# EAGLE design Controller (EAGLE 9.6.2)

## Sheet 1 of 2
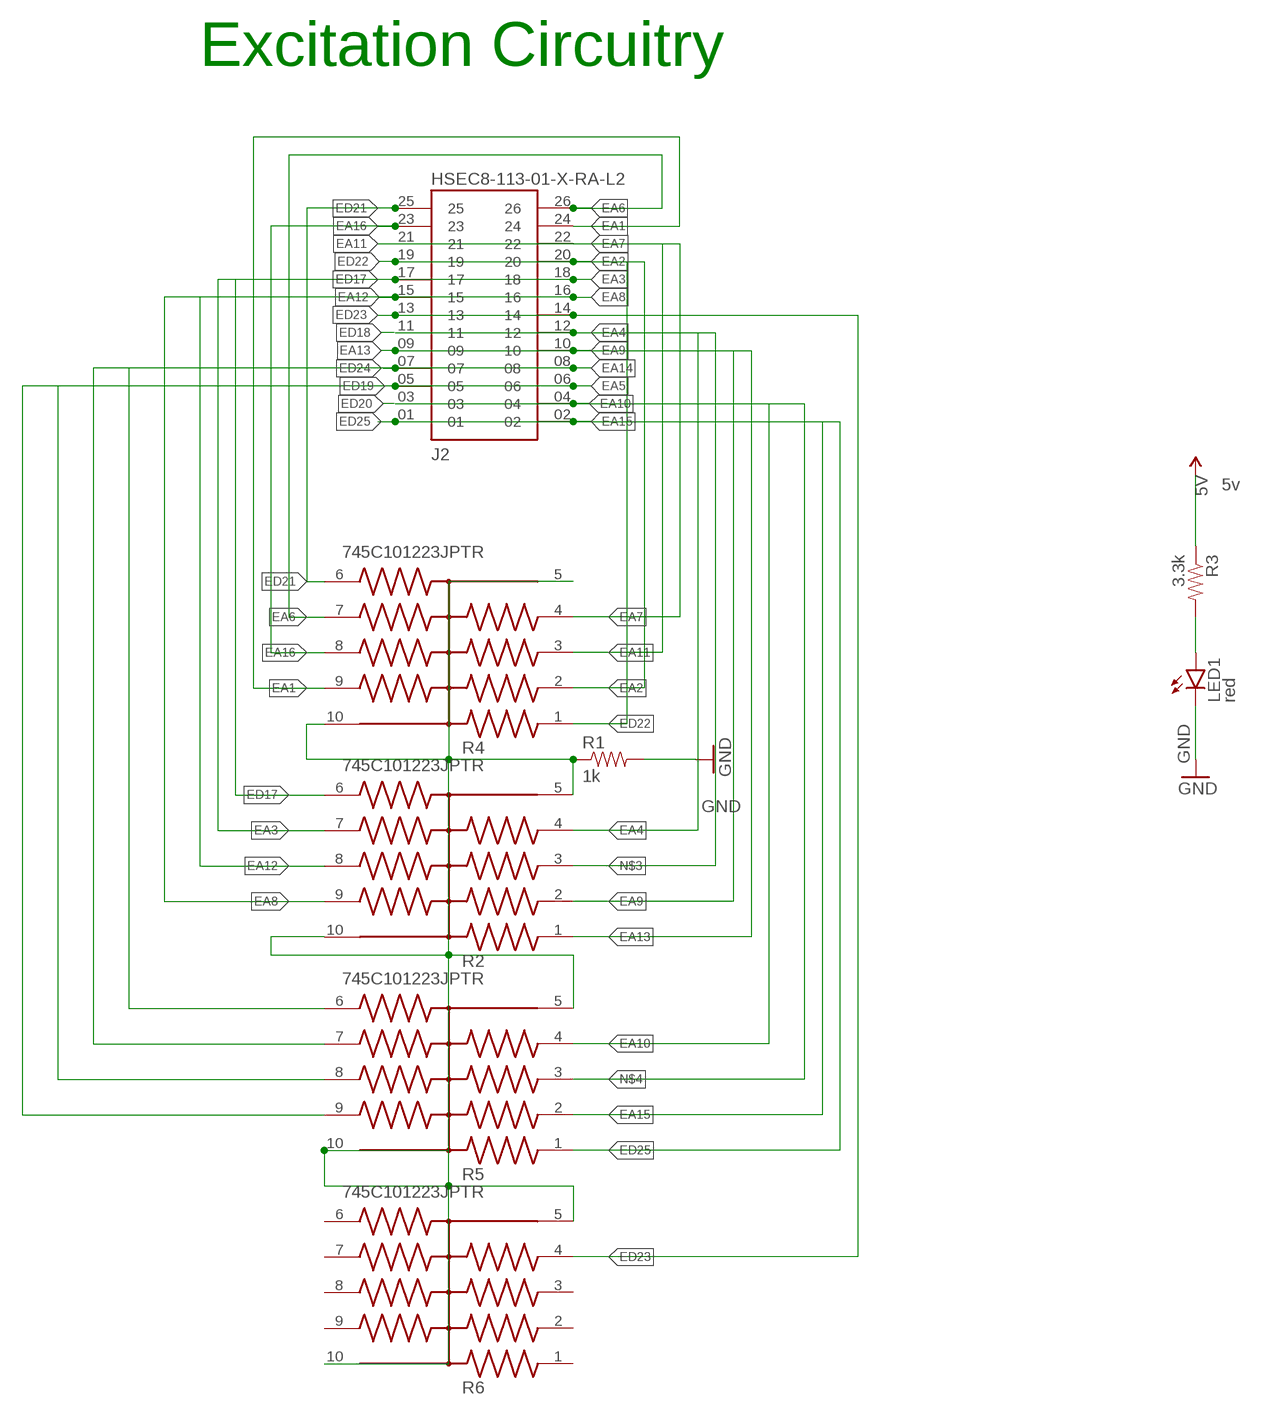
[diagram p0: schematic, sheet 1, part 1 of 2]
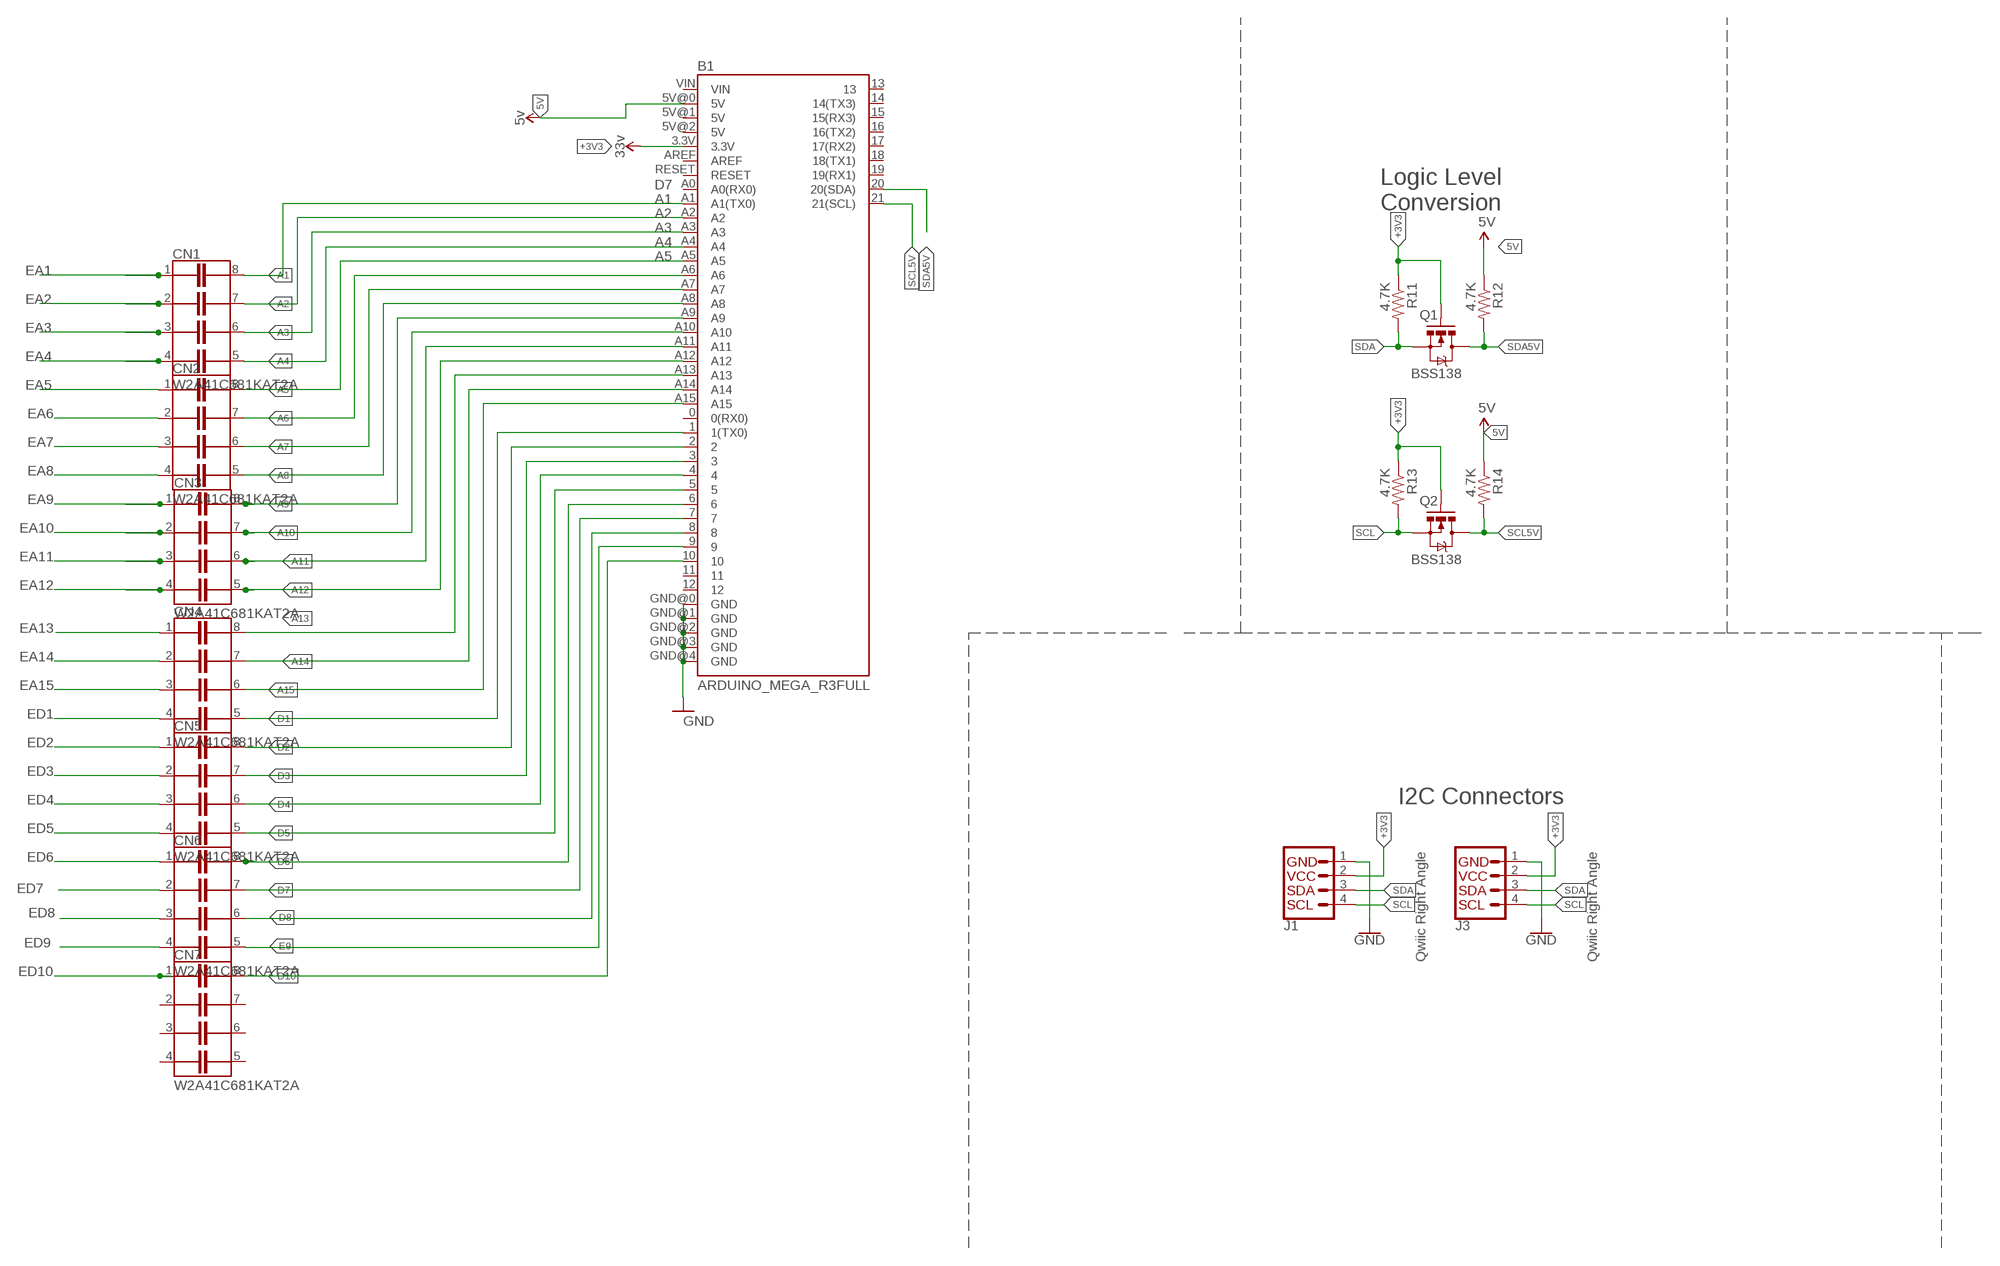
[diagram p1: schematic, sheet 1, part 2 of 2]

### Parts
B1  ARDUINO_MEGA_R3FULL  [ARDUINO_MEGA]
CN1  W2A41C681KAT2A  [CAPCAXE50P210X130X94-8N]
CN2  W2A41C681KAT2A  [CAPCAXE50P210X130X94-8N]
CN3  W2A41C681KAT2A  [CAPCAXE50P210X130X94-8N]
CN4  W2A41C681KAT2A  [CAPCAXE50P210X130X94-8N]
CN5  W2A41C681KAT2A  [CAPCAXE50P210X130X94-8N]
CN6  W2A41C681KAT2A  [CAPCAXE50P210X130X94-8N]
CN7  W2A41C681KAT2A  [CAPCAXE50P210X130X94-8N]
J1  Qwiic Right Angle  I2C_STANDARDQWIIC  [1X04_1MM_RA]
J2  HSEC8-113-01-X-RA-L2  [SAMTEC_HSEC8-113-01-X-RA-L2]
J3  Qwiic Right Angle  I2C_STANDARDQWIIC  [1X04_1MM_RA]
LED1  red  LED1206  [LED-1206]
Q1  BSS138  MOSFET-NCHANNELBSS138  [SOT23-3]
Q2  BSS138  MOSFET-NCHANNELBSS138  [SOT23-3]
R1  1k  RESISTOR0402  [0402]
R2  745C101223JPTR  [RESCAV127P640X310X70-10N]
R3  3.3k  RESISTOR0402  [0402]
R4  745C101223JPTR  [RESCAV127P640X310X70-10N]
R5  745C101223JPTR  [RESCAV127P640X310X70-10N]
R6  745C101223JPTR  [RESCAV127P640X310X70-10N]
R11  4.7K  4.7KOHM-1/10W-1%(0603)  [0603-RES]
R12  4.7K  4.7KOHM-1/10W-1%(0603)  [0603-RES]
R13  4.7K  4.7KOHM-1/10W-1%(0603)  [0603-RES]
R14  4.7K  4.7KOHM-1/10W-1%(0603)  [0603-RES]

### Nets
5V: B1.5V@0(5V) R3.1 R12.1 R14.1 ; supply symbol labelled 5v
+3V3 [power]: B1.3.3V J1.2 J3.2 Q1.1(G) Q2.1(G) R11.1 R13.1 ; supply symbol labelled 33v
A1: B1.A1(A1(TX0)) CN1.8
A2: B1.A2 CN1.7
A3: B1.A3 CN1.6
A4: B1.A4 CN1.5
A5: B1.A5 CN2.8
A6: B1.A6 CN2.7
A7: B1.A7 CN2.6
A8: B1.A8 CN2.5
A9: B1.A9 CN3.8
A10: B1.A10 CN3.7
A11: B1.A11 CN3.6
A12: B1.A12 CN3.5
A13: B1.A13 CN4.8
A14: B1.A14 CN4.7
A15: B1.A15 CN4.6
D1: B1.1(1(TX0)) CN4.5
D2: B1.2 CN5.8
D3: B1.3 CN5.7
D4: B1.4 CN5.6
D5: B1.5 CN5.5
D6: B1.6 CN6.8
D7: B1.7 CN6.7
D8: B1.8 CN6.6
D10: B1.10 CN7.8
E9: B1.9 CN6.5
EA1: CN1.1 J2.24 R4.9
EA2: CN1.2 J2.20 R4.2
EA3: CN1.3 J2.18 R2.7
EA4: CN1.4 J2.12 R2.4
EA5: CN2.1 J2.06 R5.9
EA6: CN2.2 J2.26 R4.7
EA7: CN2.3 J2.22 R4.4
EA8: CN2.4 J2.16 R2.9
EA9: CN3.1 J2.10 R2.2
EA10: CN3.2 J2.04 R5.4
EA11: CN3.3 J2.21 R4.3
EA12: CN3.4 J2.15 R2.8
EA13: CN4.1 J2.09 R2.1
EA14: CN4.2 J2.08 R5.7
EA15: CN4.3 J2.02 R5.2
EA16: J2.23 R4.8
ED1: CN4.4
ED2: CN5.1
ED3: CN5.2
ED4: CN5.3
ED5: CN5.4
ED6: CN6.1
ED7: CN6.2
ED8: CN6.3
ED9: CN6.4
ED10: CN7.1
ED17: J2.17 R2.6
ED19: J2.05 R5.8
ED21: J2.25 R4.6
ED22: J2.19 R4.1
ED23: J2.13 J2.14 R6.4
ED24: J2.07 R5.6
ED25: J2.01 R5.1
GND: B1.GND@0(GND) B1.GND@1(GND) B1.GND@2(GND) B1.GND@3(GND) B1.GND@4(GND) J1.1 J3.1 LED1.C R1.2
N$1: LED1.A R3.2
N$2: R1.1 R2.5 R2.10 R4.5 R4.10 R5.5 R5.10 R6.5 R6.10
N$3: J2.11 R2.3
N$4: J2.03 R5.3
SCL: J1.4 J3.4 Q2.2(S) R13.2
SCL5V: B1.21(21(SCL)) Q2.3(D) R14.2
SDA: J1.3 J3.3 Q1.2(S) R11.2
SDA5V: B1.20(20(SDA)) Q1.3(D) R12.2
Unconnected: B1.0(0(RX0)) B1.5V@1(5V) B1.5V@2(5V) B1.11 B1.12 B1.13 B1.14(14(TX3)) B1.15(15(RX3)) B1.16(16(TX2)) B1.17(17(RX2)) B1.18(18(TX1)) B1.19(19(RX1)) B1.A0(A0(RX0)) B1.AREF B1.RESET B1.VIN CN7.2 CN7.3 CN7.4 CN7.5 CN7.6 CN7.7 R6.1 R6.2 R6.3 R6.6 R6.7 R6.8 R6.9

### Notes on the sheet
- Excitation Circuitry
- Logic Level
  Conversion
- I2C Connectors

## Sheet 2 of 2

## Library data of the parts
B1 = shields:ARDUINO_MEGA_R3: Arduino Mega R3 ATmega2560 R3 compatible footprint with additional header pins removed
CN1-CN7 = W2A41C681KAT2A:W2A41C681KAT2A: Cap Ceramic Array 680pF 100V X7R 10% 0508 SMD 4 Capacitor 125°C Paper T/R/Embossed T/R Check availability <https://pricing.snapeda.com/parts/W2A41C681KAT2A/AVX/view-part?ref=eda>; AVAILABILITY: In Stock; DESCRIPTION: 680pF Isolated Capacitor 4 Array 100 V X7R 0508 (1220 Metric); MF: AVX; MP: W2A41C681KAT2A; PACKAGE: 0508 AVX; PRICE: None; PURCHASE-URL: https://pricing.snapeda.com/search?q=W2A41C681KAT2A&ref=eda
J1 J3 = SparkFun-Connectors:I2C_STANDARD: SparkFun I2C Standard Pinout Header SparkFun has standardized on a pinout for all I2C based sensor breakouts. This pinout allows I2C boards to be plugged directly into the headers on Arduino Uno compatible boards, and to be daisy chained easily. Example SparkFun Products: SparkFun Atmospheric Sensor Breakout - BME280 <https://www.sparkfun.com/products/13676> SparkFun Altitude/Pressure Sensor Breakout - MPL3115A2 <https://www.sparkfun.com/products/11084> SparkFun TOF Range Finder Sensor - VL6180 <https://www.sparkfun.com/products/12785>; PROD_ID: CONN-13729
J2 = HSEC8-113-01:HSEC8-113-01-X-RA-L2: 26 Position Female Connector Non Specified - Dual Edge Gold 0.031" (0.80mm) Black; MANUFACTURER: Samtec; MAXIMUM_PACKAGE_HEIGHT: 5.2 mm; PARTREV: Z; STANDARD: Manufacturer Recommendations
LED1 = SparkFun-LED:LED: LED (Generic) Standard schematic elements and footprints for 5mm, 3mm, 1206, and 0603 sized LEDs. Generic LEDs with no color specified.
Q1 Q2 = SparkFun-DiscreteSemi:MOSFET-NCHANNEL: Common NMOSFET Parts MFG P/N Store ID Prod ID FDD8780 TRANS-09984 SI7820DN TRANS-11055 FDS6630A IC-08089 2N7002PW TRANS-11151 FQP30N06L COM-10213 TRANS-10060 BSS123LT1G TRANS-08345 BSS138 TRANS-00830 BS170 2N7000; PROD_ID: TRANS-00830; VALUE: 200mA/50V
R1 R3 = SparkFun-Resistors:RESISTOR: Generic Resistor Package
R2 R4-R6 = 745C101223JPTR:745C101223JPTR: Res Thick Film Array 1K Ohm 5% 1/2W Â±200ppm/Â°C BUS Molded 10-Pin 2512 Concave SMD Plastic T/R Check availability <https://pricing.snapeda.com/parts/745C101223JPTR/CTS%20Components/view-part?ref=eda>; AVAILABILITY: In Stock; DESCRIPTION: RES ARRAY 8 RES 22K OHM 2512; MF: CTS Components; MP: 745C101223JPTR; PACKAGE: 2512 CTS Components; PRICE: None
R11-R14 = SparkFun-Resistors:4.7KOHM-1/10W-1%(0603): RES-07857; PROD_ID: RES-07857

## Net classes
0 Default: width 0.203 mm
1 power: width 0.61 mm, drill 0.61 mm, clearance 0.254 mm
2 gnd: width 0.305 mm, drill 0.559 mm, clearance 0.254 mm

## Board
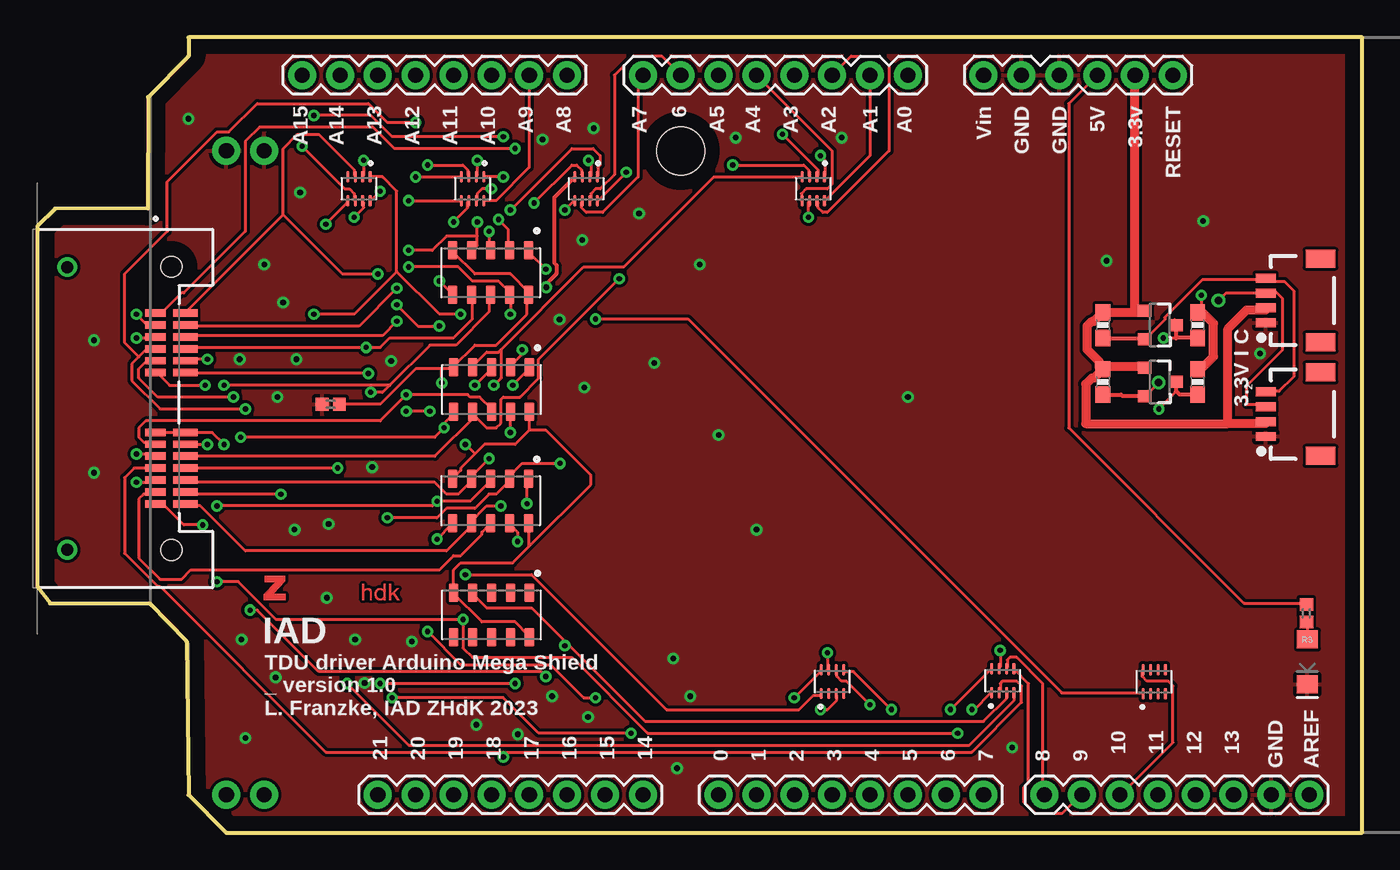
[diagram p2: board, top side]
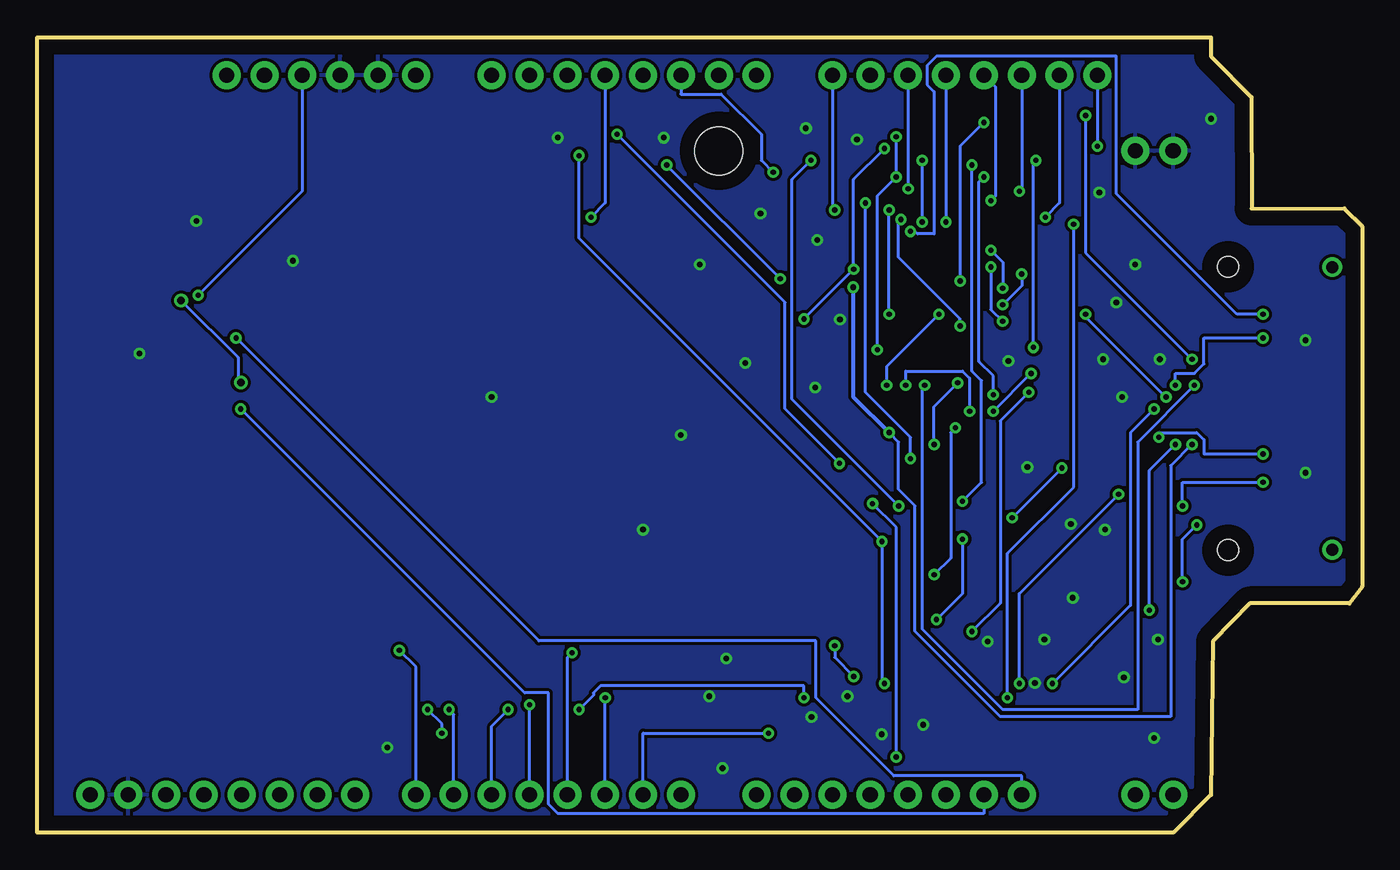
[diagram p3: board, bottom side, seen from below]

Size 88.89 x 53.34 mm. Coordinates in mm from the lower left corner, seen from the top.
Outline: 88.89,53.34 10.15,53.34 10.15,52.07 7.44,49.32 7.42,41.86 1.2,41.85 0,40.66 0,16.5 0.86,15.38 7.56,15.38 10.02,12.83 10.15,2.54 12.69,0 88.89,0 88.89,53.34
Copper layers (1*16): Top 0.035mm / dielectric 1.5mm / Bottom 0.035mm
Design rules "default *": minimum track width 6mil, minimum drill 0.35mm, track to track 8mil, track to pad 8mil, pad to pad 8mil, via to via 8mil, smd to smd 0mil, copper to edge 40mil, drill to drill 6mil, minimum pad ring 10mil, minimum via ring 8mil, stop-mask expansion 0mil, vias tented up to drill 15mil, thermal gap 10mil

### Footprints (pad centres in the part's own frame; a part is rotated, then mirrored left to right if it is on the bottom)
ARDUINO_MEGA = drill 1.016 pad 1.88: 0 13.97,24.13; 1 11.43,24.13; 2 8.89,24.13; 3 6.35,24.13; 3.3V -13.97,-24.13; 4 3.81,24.13; 5 1.27,24.13; 5V@0 -11.43,-24.13; 5V@1 44.45,24.13; 5V@2 46.99,24.13; 6 -1.27,24.13; 7 -3.81,24.13; 8 -7.874,24.13; 9 -10.414,24.13; 10 -12.954,24.13; 11 -15.494,24.13; 12 -18.034,24.13; 13 -20.574,24.13; 14 19.05,24.13; 15 21.59,24.13; 16 24.13,24.13; 17 26.67,24.13; 18 29.21,24.13; 19 31.75,24.13; 20 34.29,24.13; 21 36.83,24.13; A0 1.27,-24.13; A1 3.81,-24.13; A2 6.35,-24.13; A3 8.89,-24.13; A4 11.43,-24.13; A5 13.97,-24.13; A6 16.51,-24.13; A7 19.05,-24.13; A8 24.13,-24.13; A9 26.67,-24.13; A10 29.21,-24.13; A11 31.75,-24.13; A12 34.29,-24.13; A13 36.83,-24.13; A14 39.37,-24.13; A15 41.91,-24.13; AREF -25.654,24.13; GND@0 -8.89,-24.13; GND@1 -6.35,-24.13; GND@2 44.45,-19.05; GND@3 46.99,-19.05; GND@4 -23.114,24.13; RESET -16.51,-24.13; VIN -3.81,-24.13 | hole 3.2: 16.51,-19.05
CAPCAXE50P210X130X94-8N = smd 0.77 x 0.21: 1 -0.8,0.75; 2 -0.8,0.25; 3 -0.8,-0.25; 4 -0.8,-0.75; 5 0.8,-0.75; 6 0.8,-0.25; 7 0.8,0.25; 8 0.8,0.75
1X04_1MM_RA = smd 0.6 x 1.35: 1 -1.5,0; 2 -0.5,0; 3 0.5,0; 4 1.5,0 | smd 1.2 x 2: NC1 2.8,-3.675; NC2 -2.8,-3.675
SAMTEC_HSEC8-113-01-X-RA-L2 = smd 0.5 x 1.35: 01 -6.4,-1.075; 03 -5.6,-1.075; 05 -4.8,-1.075; 07 -4,-1.075; 09 -3.2,-1.075; 11 -2.4,-1.075; 13 1.6,-1.075; 15 2.4,-1.075; 17 3.2,-1.075; 19 4,-1.075; 21 4.8,-1.075; 23 5.6,-1.075; 25 6.4,-1.075 | smd 0.5 x 1.65: 02 -6.4,0.925; 04 -5.6,0.925; 06 -4.8,0.925; 08 -4,0.925; 10 -3.2,0.925; 12 -2.4,0.925; 14 1.6,0.925; 16 2.4,0.925; 18 3.2,0.925; 20 4,0.925; 22 4.8,0.925; 24 5.6,0.925; 26 6.4,0.925 | drill 0.81: S1 -9.48,-7; S2 9.48,-7 | hole 1.4: -9.5,0; 9.5,0
LED-1206 = smd 1.2 x 1.4: A -1.5,0; C 1.5,0
SOT23-3 = smd 0.8 x 0.9: 1 -0.95,-1; 2 0.95,-1; 3 0,1.1
0402 = smd 0.85 x 0.9: 1 -0.58,0; 2 0.58,0
RESCAV127P640X310X70-10N = smd 1.23 x 0.63: 1 -1.495,2.54; 2 -1.495,1.27; 3 -1.495,0; 4 -1.495,-1.27; 5 -1.495,-2.54; 6 1.495,-2.54; 7 1.495,-1.27; 8 1.495,0; 9 1.495,1.27; 10 1.495,2.54
0603-RES = smd 1.1 x 1: 1 -0.85,0; 2 0.85,0

### Placement (x,y rotation side)
B1  59.68,26.67 180 top
CN1  52.06,43.18 270 top
CN2  36.82,43.18 270 top
CN3  29.2,43.18 270 top
CN4  21.58,43.18 270 top
CN5  53.34,10.13 90 top
CN6  64.77,10.19 90 top
CN7  74.93,10.13 90 top
J1  82.41,35.69 90 top
J2  9.01,28.45 270 top
J3  82.41,28.07 90 top
LED1  85.21,11.46 270 top
Q1  75.3,30.23 270 top
Q2  75.3,34.04 270 top
R1  19.7,28.73 180 top
R2  30.47,29.72 270 top
R3  85.14,14.72 270 top
R4  30.41,22.25 270 top
R5  30.41,37.55 270 top
R6  30.47,14.61 270 top
R11  71.49,30.23 270 top
R12  77.84,30.23 270 top
R13  71.49,34.04 270 top
R14  77.84,34.04 270 top
U$1  [ZHDK_LOGO]  14.47,17.78 0 top

### Tracks (layer width: path | path; a pad name or v marks a point on that pad's centre or on a via)
5V  (via drill 0.35)
  Top 0.203: R12.1 77.93,31.12 78.05,31.08 | B1.5V@0 69.2,48.9 69.2,27.15 80.95,15.4 85.08,15.4 R3.1 | v78.09,36.04 78.09,35.24 R14.1
  Top 0.61: R14.1 78.01,35.05 78.9,34.16 78.9,31.92 78.05,31.08
  Bottom 0.203: v78.09,36.04 71.11,43.02 B1.5V@0
+3V3
  Top 0.61: 79.87,27.43 79.87,33.78 81.14,35.05 82.41,35.05 J1.2 | 79.87,27.43 82.41,27.43 J3.2 | 71.24,31.24 74.41,31.24 Q1.1 | 74.09,35.05 73.65,35.05 B1.3.3V | 74.09,35.05 Q2.1 | 71.55,35.05 R13.1 | 71.24,31.24 R11.1 70.9,30.48 70.76,30.48 70.35,30.07 70.35,27.43 79.87,27.43 | R13.1 70.9,34.3 70.76,34.3 70.43,33.97 70.43,32.41 71.24,31.6 71.24,31.24 | R13.1 73.93,34.89 74.09,35.05
A1
  Top 0.203: B1.A1 55.87,45.4 52.85,42.39 CN1.8
A2
  Top 0.203: B1.A2 54.6,52.07 56.5,52.07 57.14,51.44 57.14,45.72 53.01,41.59 52.69,41.59 52.38,41.91 52.38,42.23 CN1.7
A3  (via drill 0.35)
  Top 0.203: v51.74,41.27 51.74,42.23 CN1.6
  Bottom 0.203: v51.74,41.27 50.79,42.23 B1.A3
A4
  Top 0.203: B1.A4 53.33,45.72 53.33,43.5 53.01,43.18 51.58,43.18 51.26,42.86 51.26,42.39 CN1.5
A5  (via drill 0.35)
  Top 0.203: v39.52,44.29 37.61,42.39 CN2.8
  Bottom 0.203: v39.52,44.29 40.31,45.09 40.31,46.83 43.01,49.53 45.71,49.53 B1.A5
A6
  Top 0.203: B1.A6 41.9,52.07 39.99,52.07 38.72,50.8 38.72,44.13 37.77,43.18 37.45,43.18 37.14,42.86 37.14,42.39 CN2.7
A7
  Top 0.203: B1.A7 40.31,50.48 40.31,43.97 37.93,41.59 36.82,41.59 36.5,41.91 36.5,42.23 CN2.6
A8  (via drill 0.35)
  Top 0.203: CN2.5 36.02,42.38 v35.39,41.75
  Bottom 0.203: v35.39,41.75 35.55,41.91 B1.A8
A9
  Top 0.203: B1.A9 33.01,44.61 30.79,42.39 29.99,42.39 CN3.8
A10  (via drill 0.35)
  Top 0.203: v30.47,43.18 29.83,43.18 29.52,42.86 29.52,42.39 CN3.7
  Bottom 0.203: B1.A10 v30.47,43.18
A11  (via drill 0.35)
  Top 0.203: v27.93,40.96 28.88,41.91 28.88,42.23 CN3.6
  Bottom 0.203: B1.A11 v27.93,40.96
A12  (via drill 0.35)
  Top 0.203: v24.91,42.39 28.4,42.39 CN3.5
  Bottom 0.203: v24.91,42.39 24.59,42.7 24.59,50.01 B1.A12
A13  (via drill 0.35)
  Top 0.203: v23.01,43.02 22.37,42.39 CN4.8
  Bottom 0.203: v23.01,43.02 22.85,43.18 B1.A13
A14  (via drill 0.35)
  Top 0.203: v21.26,41.27 21.9,41.91 21.9,42.23 CN4.7
  Bottom 0.203: v21.26,41.27 20.31,42.23 B1.A14
A15  (via drill 0.35)
  Top 0.203: v17.77,46.04 20.63,43.18 20.94,43.18 21.26,42.86 21.26,42.39 CN4.6
  Bottom 0.203: B1.A15 v17.77,46.04
D1  (via drill 0.35)
  Top 0.203: v19.36,40.8 20.78,42.23 CN4.5 | v23.8,9.05 31.26,9.05 33.64,6.67 v39.83,6.67
  Bottom 0.203: v19.36,40.8 19.36,23.18 23.8,18.73 v23.8,9.05 | v39.83,6.67 48.25,6.67 B1.1
D2  (via drill 0.35)
  Top 0.203: v50.79,9.05 52.53,10.8 CN5.8
  Bottom 0.203: B1.2 v50.79,9.05
D3  (via drill 0.35)
  Top 0.203: v53.01,12.07 53.01,10.95 CN5.7
  Bottom 0.203: v53.01,12.07 53.33,11.75 B1.3
D4  (via drill 0.35)
  Top 0.203: v55.87,8.57 54.28,10.16 53.96,10.16 53.65,10.48 53.65,10.8 CN5.6
  Bottom 0.203: B1.4 v55.87,8.57
D5  (via drill 0.35)
  Top 0.203: v57.3,8.25 54.76,10.8 54.12,10.8 CN5.5
  Bottom 0.203: v57.3,8.25 58.41,7.14 B1.5
D6  (via drill 0.35)
  Top 0.203: v61.27,8.25 63.96,10.95 CN6.8
  Bottom 0.203: v61.27,8.25 60.95,7.94 B1.6
D7  (via drill 0.35)
  Top 0.203: v64.6,12.22 64.6,11.11 CN6.7
  Bottom 0.203: v64.6,12.22 63.49,11.11 B1.7
D8
  Top 0.203: CN6.6 65.08,11.11 65.08,11.59 65.23,11.75 65.71,11.75 67.46,10 67.46,2.54 B1.8
D10
  Top 0.203: CN7.8 74.12,10.8 74.12,10.48 74.44,10.16 75.87,10.16 76.19,9.84 76.19,6.03 72.7,2.54 B1.10
E9
  Top 0.203: CN6.5 65.55,10.95 66.5,10 66.5,3.33 66.19,3.02 66.19,2.06 66.98,1.27 68.73,1.27 70,2.54 B1.9
EA1  (via drill 0.35)
  Top 0.203: v52.53,45.4 52.85,45.09 52.85,44.13 CN1.1 | v32.21,19.53 32.21,20.16 31.74,20.64 R4.9 | v16.34,22.7 9.99,22.7 J2.24 | v32.06,10 v23.01,10
  Bottom 0.203: v52.53,45.4 52.53,39.85 v32.21,19.53 32.21,10.16 v32.06,10 | v16.34,22.7 23.01,16.03 v23.01,10
EA2  (via drill 0.35)
  Top 0.203: v49.99,46.83 52.38,44.45 52.38,44.13 CN1.2 | v35.07,24.77 32.53,24.77 31.58,23.81 R4.2 31.74,23.65 30.79,22.7 30.31,22.7 29.36,21.75 27.45,21.75 26.82,21.11 v23.48,21.11 | v20.15,24.45 9.99,24.45 J2.20
  Bottom 0.203: v49.99,46.83 38.72,35.56 38.72,28.42 v35.07,24.77 | v23.48,21.11 v20.15,24.45
EA3  (via drill 0.35)
  Top 0.203: v46.66,44.77 51.42,44.77 51.74,44.45 51.74,44.13 CN1.3 | v39.04,37.15 33.64,31.75 33.64,30.48 32.37,29.21 31.26,29.21 31.1,29.05 31.1,27.46 30.79,27.15 30.15,27.15 29.36,27.94 | 29.36,27.94 29.2,28.1 R2.7 29.36,27.94 | 29.36,27.94 26.66,25.24 9.99,25.24 J2.18
  Bottom 0.203: v39.04,37.15 v46.66,44.77
EA4  (via drill 0.35)
  Top 0.203: 31.1,32.38 30.94,32.23 30.15,32.23 29.2,31.27 R2.4 | 31.1,32.38 36.66,37.94 39.36,37.94 45.39,43.97 51.26,43.97 CN1.4 | v22.21,30.8 9.99,30.8 J2.12 | v26.34,28.26 v24.75,28.26 | v30.63,30 31.1,30.48 31.1,32.38
  Bottom 0.203: v24.75,28.26 v22.21,30.8 | v26.34,28.26 26.34,30.48 26.82,30.96 30.63,30.96 v30.63,30
EA5  (via drill 0.35)
  Top 0.203: v31.74,41.75 35.87,45.88 37.29,45.88 37.77,45.4 37.77,44.77 37.61,44.61 37.61,44.13 CN2.1 | v31.74,34.77 31.74,36.04 R5.9 31.74,36.2 30.94,36.99 29.2,36.99 28.25,37.94 v24.91,37.94 | v24.12,34.29 23.17,33.34 9.99,33.34 J2.06
  Bottom 0.203: v31.74,34.77 v31.74,41.75 | v24.12,34.29 24.91,35.08 v24.91,37.94
EA6  (via drill 0.35)
  Top 0.203: v36.98,45.09 37.14,44.93 37.14,44.13 CN2.2 | v31.1,21.91 30.15,21.91 29.04,20.8 R4.7 29.2,20.64 27.45,18.89 13.96,18.89 10.94,21.91 9.99,21.91 J2.26
  Bottom 0.203: v36.98,45.09 38.25,43.81 38.25,29.05 v31.1,21.91
EA7  (via drill 0.35)
  Top 0.203: v33.33,42.23 35.87,44.77 36.18,44.77 36.5,44.45 36.5,44.13 CN2.3 | v30.31,25.08 29.04,23.81 R4.4 29.2,23.65 28.25,22.7 27.45,22.7 26.66,23.49 9.99,23.49 J2.22
  Bottom 0.203: v33.33,42.23 33.33,29.53 30.31,26.51 v30.31,25.08
EA8  (via drill 0.35, 0.38)
  Top 0.203: v31.74,26.83 R2.9 | v11.42,26.04 9.99,26.04 J2.16
  Top 0.254: v34.15,36.58 34.15,36.81 34.83,37.49 34.83,38.08 34.68,38.22 34.68,42.59 CN2.4
  Bottom 0.203: v31.74,26.83 31.66,26.75 31.1,26.19 31.1,23.02 29.99,21.91 29.99,13.49 24.28,7.78 12.85,7.78 12.85,24.61 v11.42,26.04
  Bottom 0.254: v34.15,36.58 34.15,29.24 31.66,26.75
EA9  (via drill 0.35)
  Top 0.203: v31.26,43.97 29.99,43.97 CN3.1 | v32.53,32.38 32.53,32.07 31.74,31.27 R2.2 | v11.42,31.75 9.99,31.75 J2.10 | v18.56,48.1 22.37,48.1 23.8,46.67 v31.26,46.67
  Bottom 0.203: v32.53,32.38 32.53,42.7 v31.26,43.97 v31.26,46.67 | v11.42,31.75 18.56,38.89 v18.56,48.1
EA10  (via drill 0.35)
  Top 0.203: v29.52,45.09 29.52,44.13 CN3.2 | 29.52,40.01 29.52,39.37 29.2,39.05 R5.4 | 29.52,40.01 v29.52,40.96 | v24.12,36.51 21.58,33.97 9.99,33.97 J2.04 | v24.91,39.05 26.5,39.05 27.45,40.01 29.52,40.01
  Bottom 0.203: v29.52,40.96 v29.52,45.09 | v24.12,36.51 24.12,38.26 v24.91,39.05
EA11  (via drill 0.35)
  Top 0.203: v26.18,44.77 28.56,44.77 28.88,44.45 28.88,44.13 CN3.3 | R4.3 30.47,23.65 29.04,22.23 v26.82,22.23 26.5,21.91 v12.05,21.91 | v6.66,23.49 7.93,23.49 J2.21
  Bottom 0.203: v26.18,44.77 26.18,30.96 25.55,30.32 25.55,23.49 v26.82,22.23 | v6.66,23.49 12.05,23.49 v12.05,21.91
EA12  (via drill 0.35)
  Top 0.203: v25.39,43.97 28.4,43.97 CN3.4 | R2.8 30.47,28.42 29.67,29.21 29.04,29.21 28.88,29.37 v24.75,29.37 23.01,27.62 7.29,27.62 6.81,27.15 6.81,26.51 7.13,26.19 7.93,26.19 J2.15
  Bottom 0.203: v25.39,43.97 25.71,43.66 25.71,31.59 24.75,30.64 v24.75,29.37
EA13  (via drill 0.35)
  Top 0.203: 24.12,37.62 24.12,43.02 23.17,43.97 22.37,43.97 CN4.1 | 24.12,37.62 26.98,34.77 v28.4,34.77 | v31.9,30 33.01,31.12 R2.1 | v13.16,29.21 8.08,29.21 6.81,30.48 6.81,31.12 7.29,31.59 7.93,31.59 J2.09 | v18.56,34.77 21.26,34.77 24.12,37.62
  Bottom 0.203: v28.4,34.77 31.9,31.27 v31.9,30 | v13.16,29.21 18.56,34.61 v18.56,34.77
EA14  (via drill 0.35)
  Top 0.203: v21.9,45.09 21.9,44.13 CN4.2 | J2.08 9.99,32.54 v22.05,32.54 23.01,32.54 23.64,33.18 27.93,33.18 29.2,34.45 29.2,36.04 R5.7
  Bottom 0.203: v21.9,45.09 22.05,44.93 v22.05,32.54
EA15  (via drill 0.35)
  Top 0.203: 16.5,41.43 16.5,45.88 17.45,46.83 18.88,46.83 21.26,44.45 21.26,44.13 CN4.3 | 16.5,41.43 9.99,34.92 J2.02 | v30.94,41.12 31.58,40.48 31.58,39.05 R5.2 | v26.98,33.97 25.55,33.97 v24.12,35.4 | v22.85,37.47 20.47,37.47 16.5,41.43
  Bottom 0.203: v30.94,41.12 31.1,40.96 31.1,38.58 26.98,34.45 v26.98,33.97 | v24.12,35.4 22.85,36.67 v22.85,37.47
EA16
  Top 0.203: R4.8 30.31,20.64 29.83,20.16 29.83,20 28.4,18.57 27.93,18.57 26.98,17.62 10.31,17.62 9.67,16.99 8.24,16.99 6.81,18.41 6.81,22.38 7.13,22.7 7.93,22.7 J2.23
ED17  (via drill 0.35)
  Top 0.203: 52.53,9.21 52.06,9.21 51.11,8.25 42.22,8.25 33.17,17.3 v28.72,17.3 | R2.6 27.93,28.1 27.29,27.46 v27.29,27.15 26.66,26.51 v13.64,26.51 | v6.66,25.4 7.93,25.4 J2.17
  Bottom 0.203: v28.72,17.3 27.61,18.41 27.61,26.83 v27.29,27.15 | v6.66,25.4 10.62,25.4 10.62,26.35 11.1,26.83 13.64,26.83 v13.64,26.51
ED19  (via drill 0.35)
  Top 0.203: 53.65,9.21 53.65,8.89 53.01,8.25 v52.53,8.25 | v37.45,9.05 36.66,9.05 34.44,11.27 28.4,11.27 v26.18,13.49 | v22.37,29.53 23.17,29.53 23.64,30 | 23.64,30 26.34,32.7 28.09,32.7 30.31,34.92 30.31,36.04 R5.8 | v6.66,33.18 7.93,33.18 J2.05 | 23.64,30 v12.53,30
  Bottom 0.203: v52.53,8.25 51.58,9.21 51.58,9.37 51.11,9.84 37.45,9.84 v37.45,9.05 | v26.18,13.49 24.28,15.4 24.28,27.62 v22.37,29.53 | v6.66,33.18 10.62,33.18 10.62,31.43 11.26,30.8 12.53,30.8 v12.53,30
ED21  (via drill 0.35)
  Top 0.203: 63.96,9.37 62.85,8.25 v62.69,8.25 | v61.74,6.67 40.95,6.67 35.87,11.75 29.2,11.75 28.56,12.38 v28.56,14.29 16.02,14.29 13.48,16.83 v12.05,16.83 | v26.82,19.68 27.77,20.64 R4.6 | v11.1,20.64 9.83,20.64 8.56,21.91 8.08,21.91 J2.25
  Bottom 0.203: v62.69,8.25 61.74,7.3 v61.74,6.67 | v28.56,14.29 26.82,16.03 v26.82,19.68 | v11.1,20.64 12.05,19.68 v12.05,16.83
ED22  (via drill 0.35)
  Top 0.203: 64.6,9.52 64.6,10 64.76,10.16 65.71,10.16 66.03,9.84 66.03,8.73 62.69,5.4 31.26,5.4 | 31.26,5.4 19.36,5.4 8.24,16.51 8.08,16.51 5.86,18.73 5.86,23.81 6.5,24.45 J2.19 | v32.85,22.07 32.85,23.65 R4.1 | 31.26,5.4 v31.26,5.08
  Bottom 0.203: v32.85,22.07 31.26,20.48 v31.26,5.08
ED23  (via drill 0.35)
  Top 0.203: J2.13 8.08,26.83 9.83,26.83 J2.14 9.99,26.83 11.74,26.83 v12.53,26.04 | 65.08,9.37 65.08,9.05 63.49,7.46 40.79,7.46 35.55,12.7 | 35.55,12.7 33.17,15.08 30.15,15.08 29.2,16.03 R6.4 | v14.28,14.92 14.75,14.92 18.88,10.8 33.8,10.8 v34.12,10.48 | 35.55,12.7 v35.39,12.54
  Bottom 0.203: v12.53,26.04 14.28,24.29 v14.28,14.92 | v34.12,10.48 35.39,11.75 v35.39,12.54
ED24  (via drill 0.35)
  Top 0.203: 65.55,9.37 65.55,8.89 62.54,5.87 24.91,5.87 v20.78,10 | v13.96,28.42 8.24,28.42 6.34,30.32 6.34,31.43 6.81,31.91 | 6.81,31.91 7.29,32.38 7.93,32.38 J2.07 | v26.98,36.99 27.77,36.2 R5.6 | v25.39,47.62 23.48,47.62 22.21,48.9 14.75,48.9 12.85,46.99 12.05,46.99 8.72,43.66 8.72,40.32 5.86,37.47 5.86,32.86 6.81,31.91
  Bottom 0.203: v20.78,10 15.55,15.24 15.55,26.83 v13.96,28.42 | v26.98,36.99 26.98,46.04 v25.39,47.62
ED25  (via drill 0.35)
  Top 0.203: 74.12,9.37 68.73,9.37 43.64,34.45 v37.45,34.45 | v34.12,37.78 33.01,38.89 R5.1 | v32.06,45.88 23.96,45.88 22.53,47.31 14.91,47.31 13.96,46.35 13.96,40.32 9.83,36.2 9.67,36.2 8.4,34.92 8.08,34.92 J2.01
  Bottom 0.203: v37.45,34.45 v34.12,37.78 34.12,43.81 v32.06,45.88
GND  (via drill 0.38)
  Top 0.203: J1.1 82.38,34.13 82.38,34.21
  other vias: 45.71,26.67 48.25,20.32 58.41,29.21 44.44,38.1 16.5,35.56 15.23,38.1 3.8,33.02 3.8,24.13 13.96,6.35 13.7,12.95 19.42,15.75 17.26,20.32 19.55,20.7 22.47,24.51 36.69,29.84 41.39,31.5 78.22,41.02 71.74,38.35 40.37,41.53 36.56,39.75 37.33,47.24 33.9,46.48 10.15,47.88 17.64,42.93 46.85,46.61 53.96,46.61 17.39,31.75 23.74,31.62 35.04,34.42 34.53,9.14 36.95,7.75 42.66,11.68 43.8,9.14 42.91,4.32 65.39,5.71 21.32,12.95 25.13,12.83 13.58,31.75 16.12,29.21 82.03,32.13 15.99,10.41 29.45,7.24 21.96,10.03 32.25,6.6
  pour Bottom: 7.15,54.87 7.15,0.19 133.13,0.19 133.13,54.87
  pour Bottom: -9.36,54.87 -9.36,0.19 117.89,0.19 117.89,54.87
  pour Top: -4.28,54.87 -4.28,0.19 124.24,0.19 124.24,54.87
N$1
  Top 0.203: R3.2 85.24,14.13 85.24,13.02 LED1.A
N$2  (via drill 0.35)
  Top 0.203: R5.5 27.93,38.89 29.36,37.47 31.74,37.47 33.01,36.2 R5.10 32.85,36.04 32.85,34.77 30.79,32.7 29.36,32.7 27.93,31.27 R2.5 27.93,31.12 27.13,31.12 | 27.13,31.12 25.39,31.12 23.01,28.73 20.31,28.73 R1.1 | 29.36,25.4 29.99,26.04 32.06,26.04 33.01,26.99 | 29.36,25.4 28.4,24.45 28.4,24.29 27.93,23.81 R4.5 | R2.10 33.01,26.99 | R6.10 33.01,13.18 32.06,14.13 29.83,14.13 27.93,16.03 R6.5 27.93,17.62 28.4,18.1 31.9,18.1 33.01,19.21 | 33.01,19.21 33.01,20.64 R4.10 | 33.01,26.99 34.12,26.99 37.14,23.97 37.14,23.34 33.01,19.21 | v27.13,30.16 27.13,31.12 | 29.36,25.4 v28.72,26.04
  Bottom 0.203: v27.13,30.16 28.72,28.58 v28.72,26.04
N$3  (via drill 0.35)
  Top 0.203: v29.36,30 30.47,31.12 R2.3 | v11.26,30 8.88,30 8.08,30.8 J2.11
  Bottom 0.203: v29.36,30 29.52,29.84 29.52,13.65 24.12,8.25 15.07,8.25 15.07,26.19 v11.26,30
N$4  (via drill 0.35)
  Top 0.203: v30.31,40.32 30.31,39.05 R5.3 | v6.66,34.77 7.29,34.13 7.93,34.13 J2.03
  Bottom 0.203: v30.31,40.32 29.99,40.32 29.83,40.16 28.72,40.16 28.72,49.69 29.2,50.16 29.2,51.44 28.56,52.07 16.5,52.07 16.5,42.86 8.4,34.77 v6.66,34.77
SCL
  Top 0.203: J3.4 82.44,29.59 83.3,29.59 84.32,30.61 84.32,36.32 83.68,36.96 82.41,36.96 82.41,37.08 | 82.41,37.08 J1.4 | Q2.2 74.41,33.15 75.64,34.38 75.64,34.56 78.17,37.08 82.41,37.08 | 71.87,33.15 R13.2
  Top 0.254: 71.87,33.15 74.41,33.15
SCL5V  (via drill 0.35)
  Top 0.203: 76.32,34.42 Q2.3 | v75.55,33.18 76.4,33.18
  Top 0.254: Q2.3 76.4,33.18 76.4,33.15 76.44,33.19 R14.2
  Bottom 0.203: v75.55,33.18 55.23,12.86 36.66,12.86 36.66,9.05 31.42,3.81 22.85,3.81 B1.21
SDA  (via drill 0.51)
  Top 0.203: 82.41,28.7 81.78,28.7 | 81.78,28.7 81.14,28.7 81.14,29.97 83.55,32.38 83.55,35.81 83.05,36.32 82.41,36.32 J1.3 79.74,36.19 v79.24,35.69 | 71.24,29.34 R11.2 | J3.3 81.91,28.57 81.78,28.7 | v75.24,30.19 74.33,29.28 74.16,29.28
  Top 0.254: Q1.2 74.16,29.28 72.82,29.28 72.72,29.38 R11.2
  Bottom 0.203: v79.24,35.69 75.43,31.88 75.43,30.38 v75.24,30.19
SDA5V  (via drill 0.35)
  Top 0.203: v75.24,28.42 76.35,29.53 76.4,29.63
  Top 0.254: Q1.3 76.4,29.63 76.66,29.38 R12.2
  Top 0.61: Q1.3 76.44,30.18 76.44,30.16
  Bottom 0.203: v75.24,28.42 56.19,9.37 54.6,9.37 54.6,1.91 53.96,1.27 25.39,1.27 B1.20

### Text on the board
tPlace: 3.3V I C | 2 | IAD | TDU driver Arduino Mega Shield / _ version 1.0 / L. Franzke, IAD ZHdK 2023